# EAGLE schematic placa (EAGLE 9.6.2)
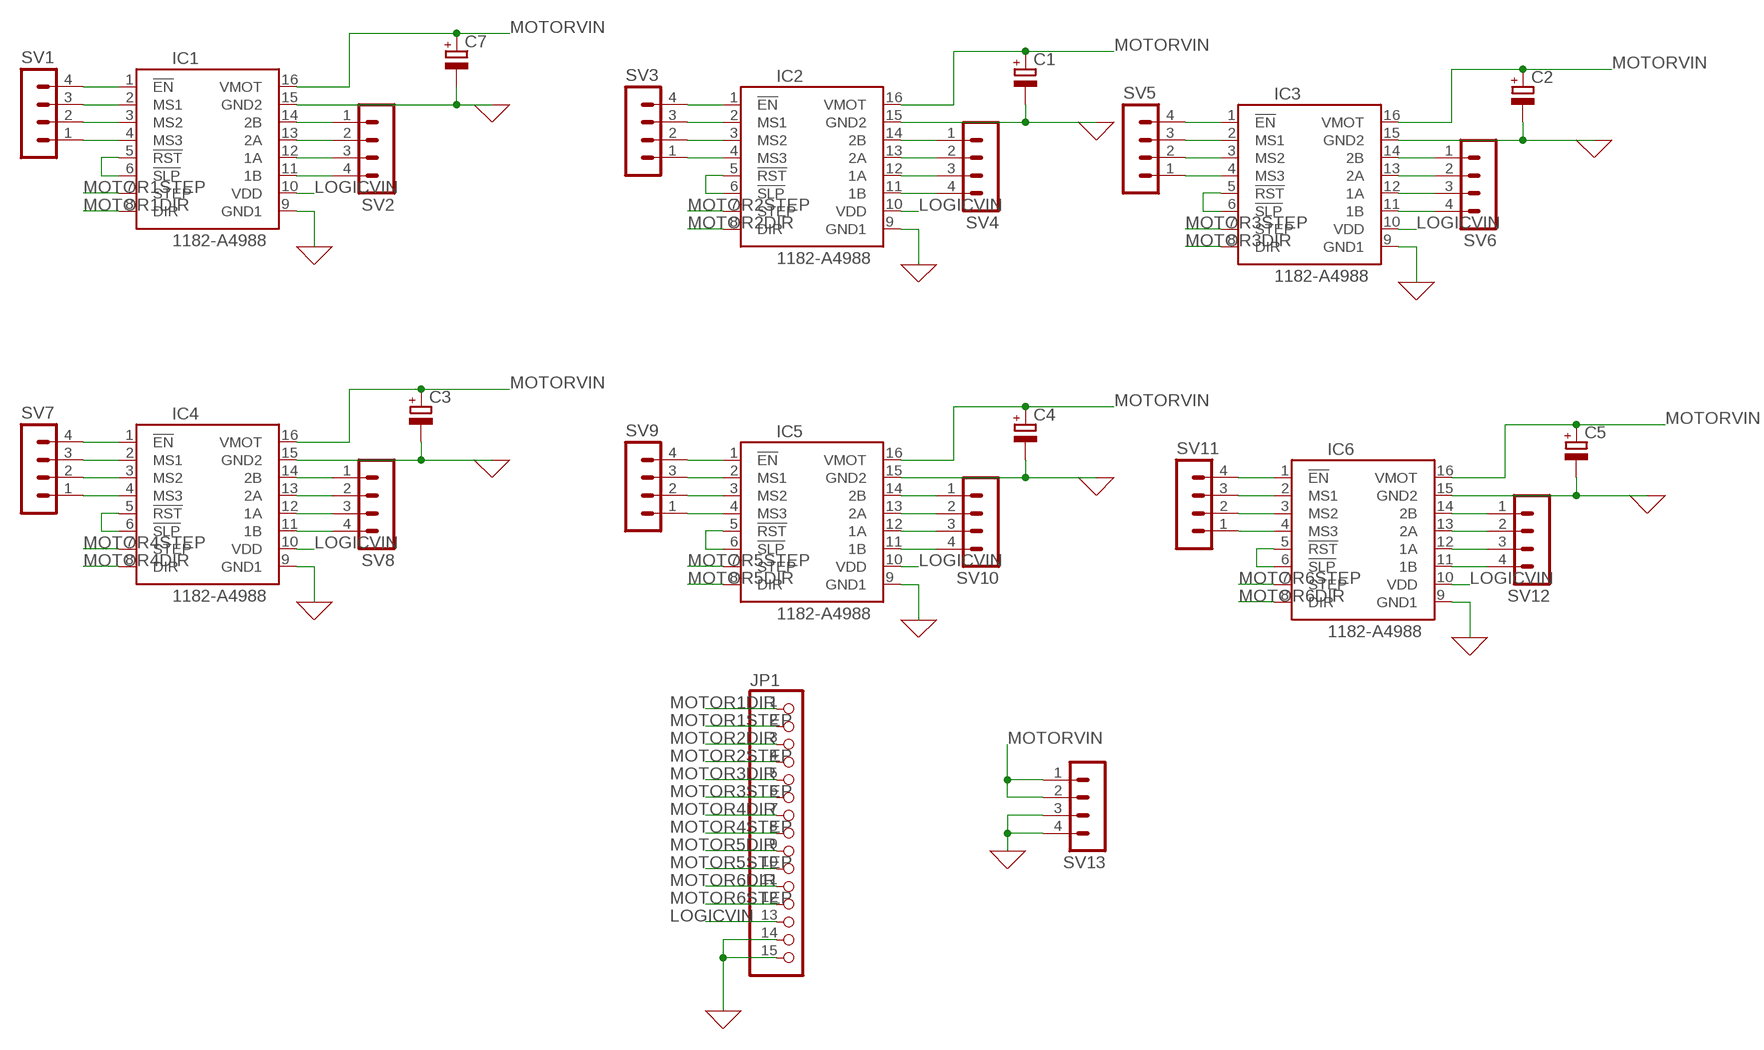
[diagram p0: schematic, sheet 1]

## Parts
C1  CPOL-EUE2.5-7  [E2,5-7]
C2  CPOL-EUE2.5-7  [E2,5-7]
C3  CPOL-EUE2.5-7  [E2,5-7]
C4  CPOL-EUE2.5-7  [E2,5-7]
C5  CPOL-EUE2.5-7  [E2,5-7]
C7  CPOL-EUE2.5-7  [E2,5-7]
IC1  1182-A4988  [A4988]
IC2  1182-A4988  [A4988]
IC3  1182-A4988  [A4988]
IC4  1182-A4988  [A4988]
IC5  1182-A4988  [A4988]
IC6  1182-A4988  [A4988]
JP1  PINHD-1X15  [1X15]
SV1  MA04-1  [MA04-1]
SV2  MA04-1  [MA04-1]
SV3  MA04-1  [MA04-1]
SV4  MA04-1  [MA04-1]
SV5  MA04-1  [MA04-1]
SV6  MA04-1  [MA04-1]
SV7  MA04-1  [MA04-1]
SV8  MA04-1  [MA04-1]
SV9  MA04-1  [MA04-1]
SV10  MA04-1  [MA04-1]
SV11  MA04-1  [MA04-1]
SV12  MA04-1  [MA04-1]
SV13  MA04-1  [MA04-1]

## Nets
0: C1.- C2.- C3.- C4.- C5.- C7.- IC1.9(GND1) IC1.15(GND2) IC2.9(GND1) IC2.15(GND2) IC3.9(GND1) IC3.15(GND2) IC4.9(GND1) IC4.15(GND2) IC5.9(GND1) IC5.15(GND2) IC6.9(GND1) IC6.15(GND2) JP1.14 JP1.15 SV13.3 SV13.4 ; supply symbol labelled GND
LOGICVIN: IC1.10(VDD) IC2.10(VDD) IC3.10(VDD) IC4.10(VDD) IC5.10(VDD) IC6.10(VDD) JP1.13
MOTOR1DIR: IC1.8(DIR) JP1.1
MOTOR1STEP: IC1.7(STEP) JP1.2
MOTOR2DIR: IC2.8(DIR) JP1.3
MOTOR2STEP: IC2.7(STEP) JP1.4
MOTOR3DIR: IC3.8(DIR) JP1.5
MOTOR3STEP: IC3.7(STEP) JP1.6
MOTOR4DIR: IC4.8(DIR) JP1.7
MOTOR4STEP: IC4.7(STEP) JP1.8
MOTOR5DIR: IC5.8(DIR) JP1.9
MOTOR5STEP: IC5.7(STEP) JP1.10
MOTOR6DIR: IC6.8(DIR) JP1.11
MOTOR6STEP: IC6.7(STEP) JP1.12
MOTORVIN: C1.+ C2.+ C3.+ C4.+ C5.+ C7.+ IC1.16(VMOT) IC2.16(VMOT) IC3.16(VMOT) IC4.16(VMOT) IC5.16(VMOT) IC6.16(VMOT) SV13.1 SV13.2
N$1: IC1.1(!EN) SV1.4
N$2: IC1.2(MS1) SV1.3
N$3: IC1.3(MS2) SV1.2
N$4: IC1.4(MS3) SV1.1
N$5: IC1.5(!RST) IC1.6(!SLP)
N$6: IC2.1(!EN) SV3.4
N$7: IC2.2(MS1) SV3.3
N$8: IC2.3(MS2) SV3.2
N$9: IC1.14(2B) SV2.1
N$10: IC1.13(2A) SV2.2
N$11: IC1.12(1A) SV2.3
N$12: IC1.11(1B) SV2.4
N$13: IC2.4(MS3) SV3.1
N$14: IC2.5(!RST) IC2.6(!SLP)
N$15: IC2.14(2B) SV4.1
N$16: IC2.13(2A) SV4.2
N$17: IC2.12(1A) SV4.3
N$18: IC2.11(1B) SV4.4
N$19: IC3.1(!EN) SV5.4
N$20: IC3.2(MS1) SV5.3
N$21: IC3.3(MS2) SV5.2
N$22: IC3.4(MS3) SV5.1
N$23: IC3.5(!RST) IC3.6(!SLP)
N$24: IC3.14(2B) SV6.1
N$25: IC3.13(2A) SV6.2
N$26: IC3.12(1A) SV6.3
N$27: IC3.11(1B) SV6.4
N$28: IC4.1(!EN) SV7.4
N$29: IC4.2(MS1) SV7.3
N$30: IC4.3(MS2) SV7.2
N$31: IC4.4(MS3) SV7.1
N$32: IC4.5(!RST) IC4.6(!SLP)
N$33: IC4.14(2B) SV8.1
N$34: IC4.13(2A) SV8.2
N$35: IC4.12(1A) SV8.3
N$36: IC4.11(1B) SV8.4
N$37: IC5.1(!EN) SV9.4
N$38: IC5.2(MS1) SV9.3
N$39: IC5.3(MS2) SV9.2
N$40: IC5.4(MS3) SV9.1
N$41: IC5.5(!RST) IC5.6(!SLP)
N$42: IC5.14(2B) SV10.1
N$43: IC5.13(2A) SV10.2
N$44: IC5.12(1A) SV10.3
N$45: IC5.11(1B) SV10.4
N$46: IC6.1(!EN) SV11.4
N$47: IC6.2(MS1) SV11.3
N$48: IC6.3(MS2) SV11.2
N$49: IC6.4(MS3) SV11.1
N$50: IC6.5(!RST) IC6.6(!SLP)
N$51: IC6.14(2B) SV12.1
N$52: IC6.13(2A) SV12.2
N$53: IC6.12(1A) SV12.3
N$54: IC6.11(1B) SV12.4

## Library data of the parts
C1-C5 C7 = rcl:CPOL-EU: POLARIZED CAPACITOR, European symbol; SPICEPREFIX: C
IC1-IC6 = pololu-stepper-driver:1182-A4988: A4988 Stepper Motor Driver Carrier #1182 A4988 Stepper Motor Driver Carrier <https://www.pololu.com/product/1182> in Japan, Suzaku Lab. Ltd. <https://suzakugiken.jp/> #1182 A4988ステッピングモータドライバ <https://szc.jp/po1182>
JP1 = pinhead:PINHD-1X15: PIN HEADER
SV1-SV13 = con-lstb:MA04-1: PIN HEADER; OC_FARNELL: unknown; OC_NEWARK: unknown